# Altium schematic sheet MID.SchDoc
size A
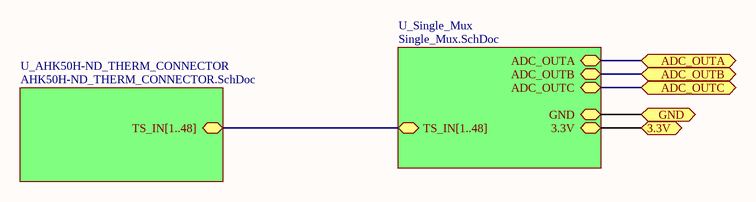
[diagram p0: MID.SchDoc]

## Sub-sheets
U_AHK50H-ND_THERM_CONNECTOR = AHK50H-ND_THERM_CONNECTOR.SchDoc: TS_IN[1..48] (bidir)
U_Single_Mux = Single_Mux.SchDoc: ADC_OUTA (bidir), TS_IN[1..48] (bidir), ADC_OUTB (bidir), ADC_OUTC (bidir), GND (bidir), 3.3V (bidir)

## Ports
3.3V (bidir), ADC_OUTA (bidir), ADC_OUTB (bidir), ADC_OUTC (bidir), GND (bidir)

## Nets
3.3V: port 3.3V, sheet U_Single_Mux/3.3V
ADC_OUTA: port ADC_OUTA, sheet U_Single_Mux/ADC_OUTA
ADC_OUTB: port ADC_OUTB, sheet U_Single_Mux/ADC_OUTB
ADC_OUTC: port ADC_OUTC, sheet U_Single_Mux/ADC_OUTC
GND: port GND, sheet U_Single_Mux/GND

## Buses and harness runs
bus sheet U_AHK50H-ND_THERM_CONNECTOR/TS_IN[1..48] = sheet U_Single_Mux/TS_IN[1..48]